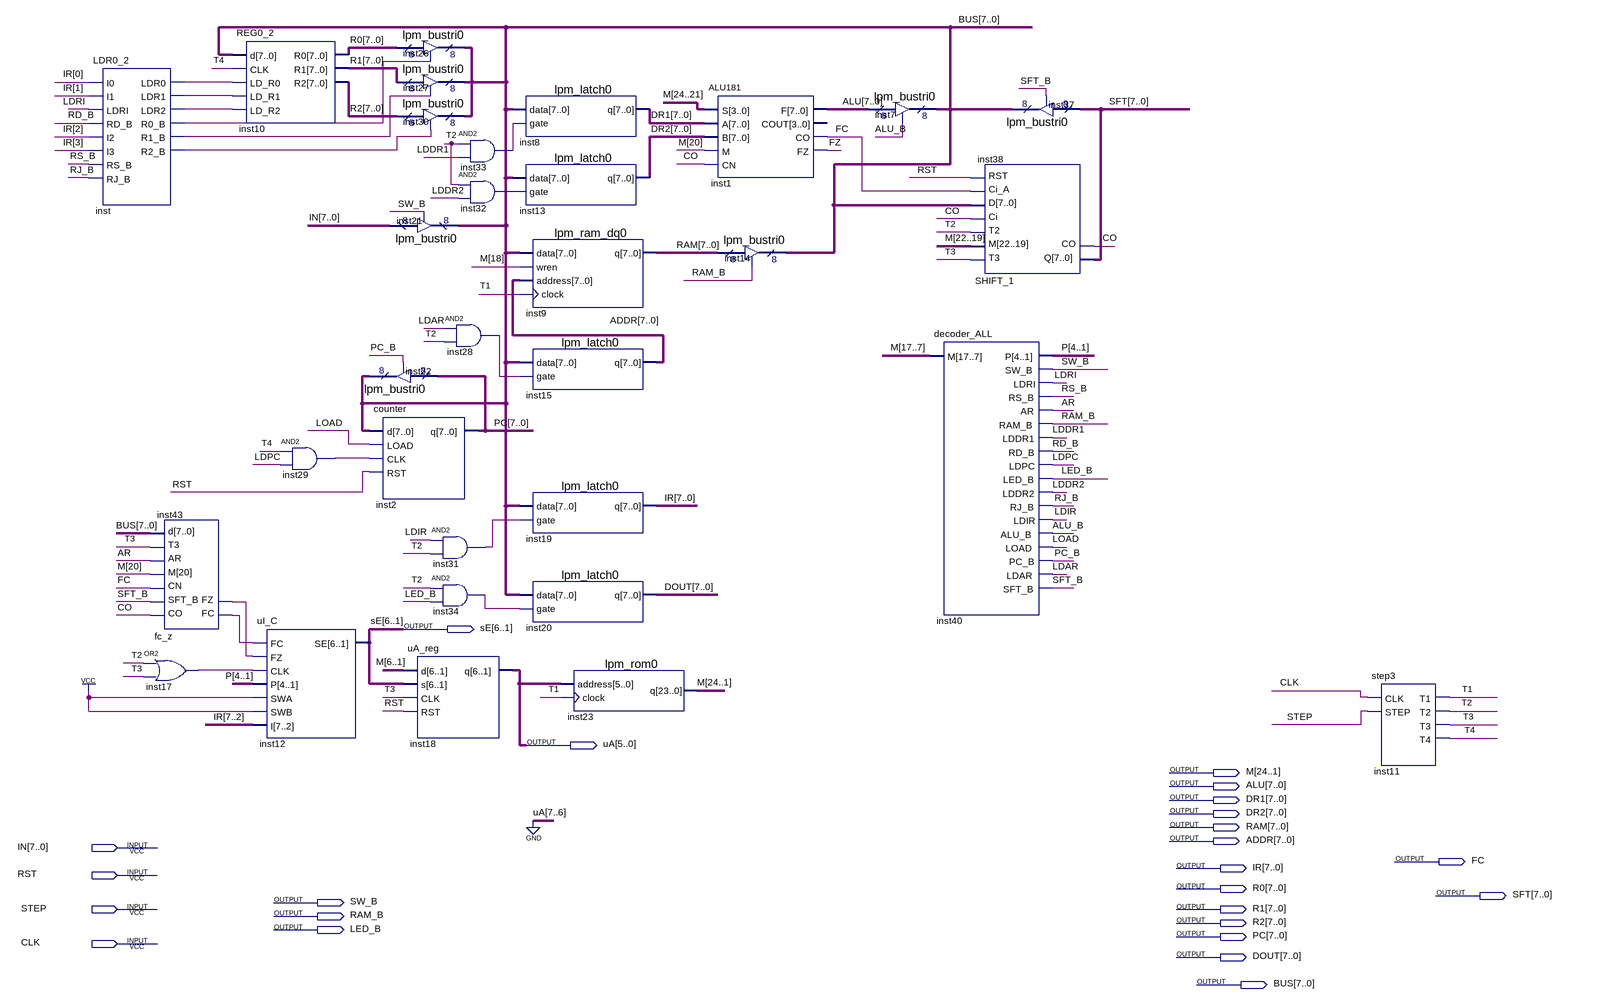
[diagram p0: schematic sheet]
// Quartus schematic CPU8_copy.bdf as structural Verilog: 32 symbols, 24 pins
module CPU8_copy (
  input  [7:0] IN,
  input  RST,
  input  STEP,
  input  CLK,
  output [6:1] sE,
  output [5:0] uA,
  output [24:1] M,
  output [7:0] ALU,
  output [7:0] DR1,
  output [7:0] DR2,
  output [7:0] RAM,
  output [7:0] ADDR,
  output FC,
  output [7:0] IR,
  output [7:0] R0,
  output [7:0] SFT,
  output SW_B,
  output [7:0] R1,
  output RAM_B,
  output [7:0] R2,
  output LED_B,
  output [7:0] PC,
  output [7:0] DOUT,
  output [7:0] BUS
);

  wire ALU_B, AR, CO, FZ, inst17_out, inst28_out, inst29_out, inst31_out, inst32_out, inst33_out, inst34_out,
       inst43_fc, inst43_fz, inst_ldr0, inst_ldr1, inst_ldr2, inst_r0_b, inst_r1_b, inst_r2_b, LDAR, LDDR1,
       LDDR2, LDIR, LDPC, LDRI, LOAD, PC_B, RD_B, RJ_B, RS_B, SFT_B, T1, T2, T3, T4;
  wire [4:1] P;

  LDR0_2 inst (
    .I0(IR[0]), .I1(IR[1]), .LDRI(LDRI), .RD_B(RD_B), .I2(IR[2]), .I3(IR[3]), .RS_B(RS_B), .RJ_B(RJ_B),
    .LDR0(inst_ldr0), .LDR1(inst_ldr1), .LDR2(inst_ldr2), .R0_B(inst_r0_b), .R1_B(inst_r1_b), .R2_B(inst_r2_b));
  or inst17 (inst17_out, T2, T3);
  fc_z inst43 (.CO(CO), .SFT_B(SFT_B), .CN(FC), .M(M[20]), .AR(AR), .T3(T3), .d(BUS), .FC(inst43_fc), .FZ(inst43_fz));
  REG0_2 inst10 (.d(BUS), .CLK(T4), .LD_R0(inst_ldr0), .LD_R1(inst_ldr1), .LD_R2(inst_ldr2), .R0(R0), .R1(R1), .R2(R2));
  uI_C inst12 (.FC(inst43_fc), .FZ(inst43_fz), .CLK(inst17_out), .P(P), .SWA(1'b1), .SWB(1'b1), .I(IR[7:2]), .SE(sE));
  and inst29 (inst29_out, T4, LDPC);
  lpm_bustri0 inst26 (.enabledt(inst_r0_b), .data(R0), .tridata(BUS));
  lpm_bustri0 inst27 (.enabledt(inst_r1_b), .data(R1), .tridata(BUS));
  lpm_bustri0 inst30 (.enabledt(inst_r2_b), .data(R2), .tridata(BUS));
  lpm_bustri0 inst21 (.enabledt(SW_B), .data(IN), .tridata(BUS));
  lpm_bustri0 inst22 (.enabledt(PC_B), .data(PC), .tridata(BUS));
  counter inst2 (.d(BUS), .LOAD(LOAD), .CLK(inst29_out), .RST(RST), .q(PC));
  uA_reg inst18 (.d(M[6:1]), .s(sE), .CLK(T3), .RST(RST), .q(uA));
  and inst33 (inst33_out, T2, LDDR1);
  and inst32 (inst32_out, T2, LDDR2);
  and inst28 (inst28_out, LDAR, T2);
  and inst31 (inst31_out, LDIR, T2);
  and inst34 (inst34_out, T2, LED_B);
  lpm_latch0 inst8 (.data(BUS), .gate(inst33_out), .q(DR1));
  lpm_latch0 inst13 (.data(BUS), .gate(inst32_out), .q(DR2));
  lpm_ram_dq0 inst9 (.data(BUS), .wren(M[18]), .address(ADDR), .clock(T1), .q(RAM));
  lpm_latch0 inst15 (.data(BUS), .gate(inst28_out), .q(ADDR));
  lpm_latch0 inst19 (.data(BUS), .gate(inst31_out), .q(IR));
  lpm_latch0 inst20 (.data(BUS), .gate(inst34_out), .q(DOUT));
  lpm_rom0 inst23 (.address(uA), .clock(T1), .q(M));
  ALU181 inst1 (.S(M[24:21]), .A(DR1), .B(DR2), .M(M[20]), .CN(CO), .F(ALU), .CO(FC), .FZ(FZ));  // open: COUT
  lpm_bustri0 inst14 (.enabledt(RAM_B), .data(RAM), .tridata(BUS));
  lpm_bustri0 inst7 (.enabledt(ALU_B), .data(ALU), .tridata(BUS));
  decoder_ALL inst40 (
    .M(M[17:7]), .P(P), .SW_B(SW_B), .LDRI(LDRI), .RS_B(RS_B), .AR(AR), .RAM_B(RAM_B), .LDDR1(LDDR1),
    .RD_B(RD_B), .LDPC(LDPC), .LED_B(LED_B), .LDDR2(LDDR2), .RJ_B(RJ_B), .LDIR(LDIR), .ALU_B(ALU_B),
    .LOAD(LOAD), .PC_B(PC_B), .LDAR(LDAR), .SFT_B(SFT_B));
  lpm_bustri0 inst37 (.enabledt(SFT_B), .data(SFT), .tridata(BUS));
  SHIFT_1 inst38 (.T3(T3), .M(M[22:19]), .T2(T2), .Ci(CO), .D(BUS), .Ci_A(FC), .RST(RST), .Q(SFT), .CO(CO));
  step3 inst11 (.CLK(CLK), .STEP(STEP), .T1(T1), .T2(T2), .T3(T3), .T4(T4));
endmodule
